# EAGLE design HLM1_Outsourced_V2 (EAGLE 9.0.0)
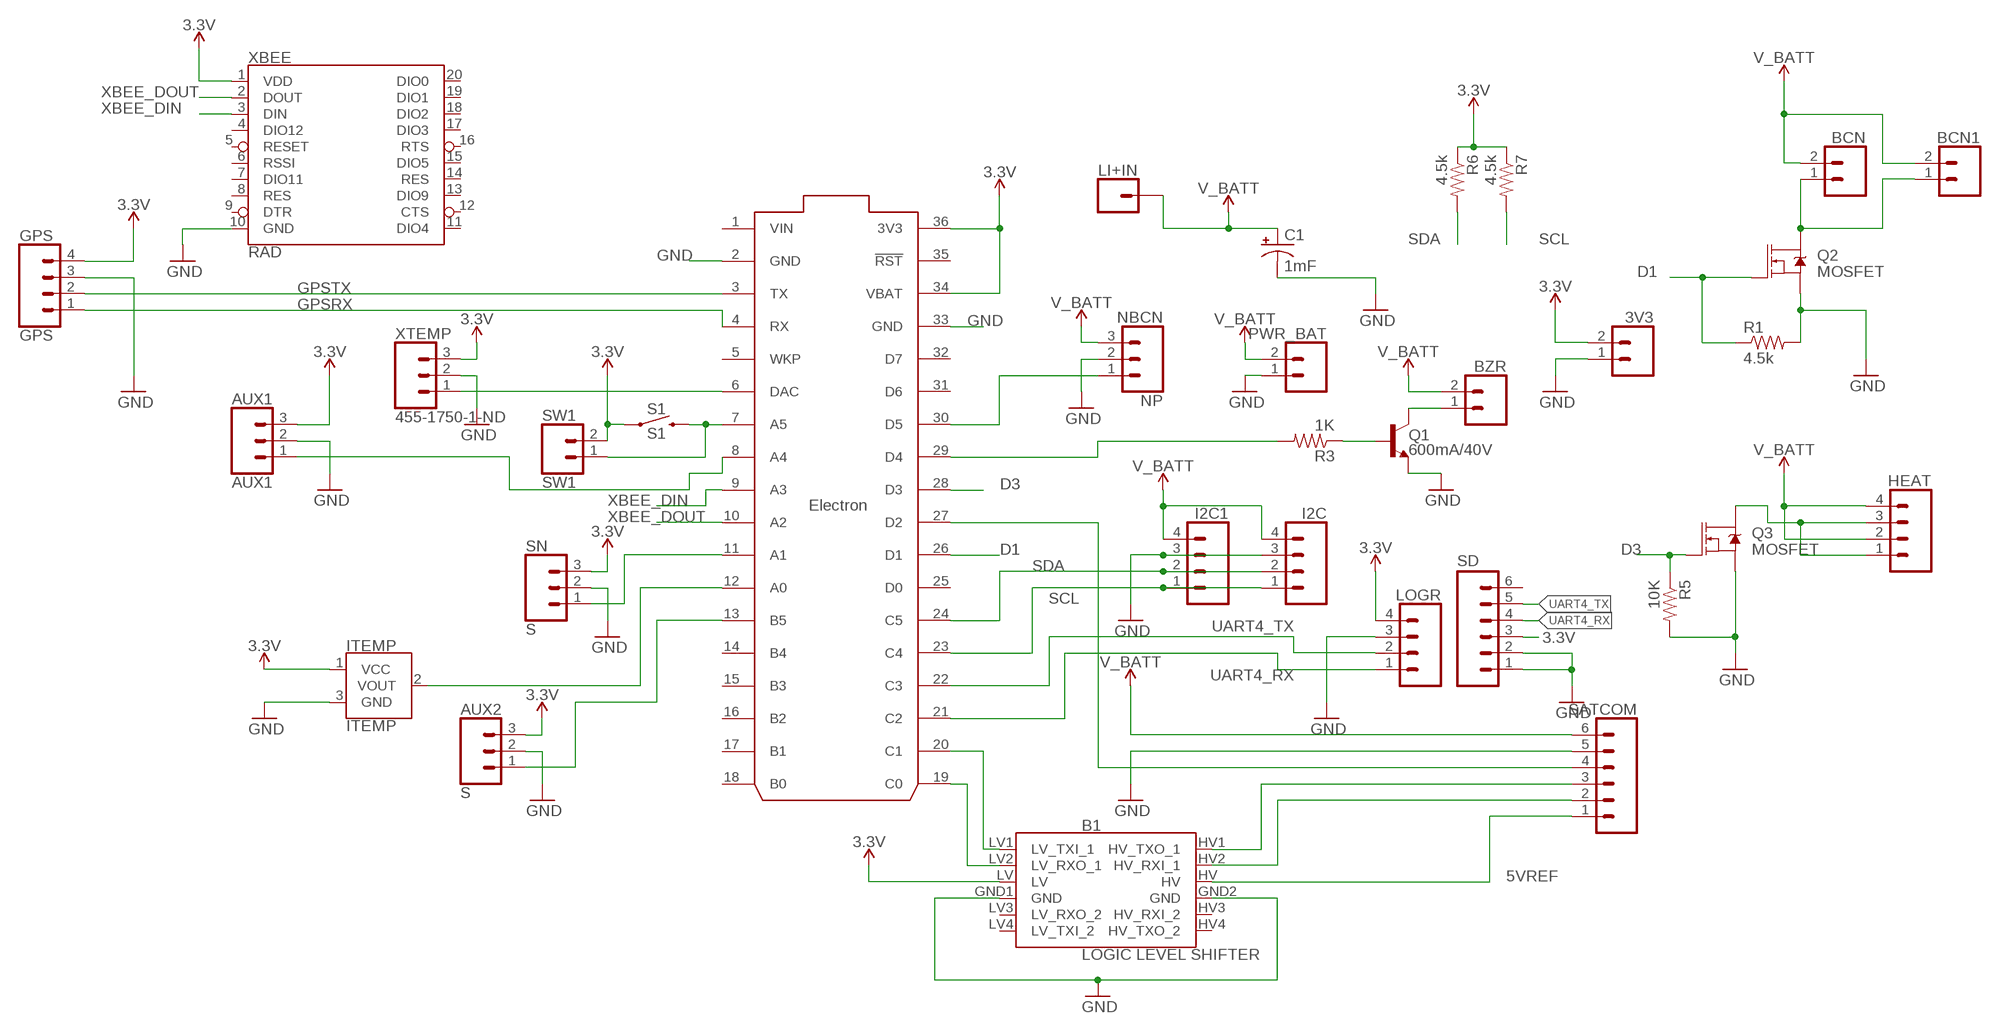
[diagram p0: schematic, sheet 1]

## Parts
3V3  CONN_02  [1X02]
AUX1  AUX1  CONN_03  [1X03]
AUX2  S  CONN_03  [1X03]
B1  LOGIC LEVEL SHIFTER  SPARKFUN_LOGIC_LEVEL_CONVERTER  [SPARKFUN_LOGIC_LEVEL_CONVERTER]
BCN  CONN_02  [1X02]
BCN1  CONN_02  [1X02]
BZR  CONN_02  [1X02]
C1  1mF  1000UF-RADIAL-5MM-25V-20%  [CPOL-RADIAL-5MM-10MM]
GPS  GPS  CONN_04  [1X04]
HEAT  CONN_04  [1X04]
I2C  CONN_04  [1X04]
I2C1  CONN_04  [1X04]
ITEMP  ITEMP  TMP36GT9  [TO-92]
LI+IN  CONN_01  [1X01]
LOGR  CONN_04  [1X04]
MCU  ELECTRON  ELECTRON_WITH_HEADERS  [ELECTRON]
NBCN  NP  CONN_03  [1X03]
PWR_BAT  CONN_02  [1X02]
Q1  600mA/40V  TRANS_NPN-P2N2222A  [TO-92]
Q2  MOSFET  MOSFET-NCH-FQP30N06L  [TO220V]
Q3  MOSFET  MOSFET-NCH-FQP30N06L  [TO220V]
R1  4.5k  RESISTORPTH-1/6W  [1/6W-RES]
R3  1K  RESISTORPTH-1/6W  [1/6W-RES]
R5  10K  RESISTORPTH-1/6W  [1/6W-RES]
R6  4.5k  RESISTORPTH-1/6W  [1/6W-RES]
R7  4.5k  RESISTORPTH-1/6W  [1/6W-RES]
S1  S1  MOMENTARY-SWITCH-SPST-PTH-6.0MM  [TACTILE_SWITCH_PTH_6.0MM]
SATCOM  CONN_06SILK_FEMALE_PTH  [1X06@1]
SD  M06NO_SILK_FEMALE_PTH  [1X06_NO_SILK]
SN  S  CONN_03  [1X03]
SW1  SW1  CONN_02  [1X02]
XBEE  RAD  XBEELONGPAD  [XBEE-LONGPAD]
XTEMP  455-1750-1-ND  CONN_03  [1X03]

## Nets
3.3V: 3V3.2 AUX1.3 AUX2.3 B1.LV GPS.4 ITEMP.1(VCC) LOGR.4 MCU.34(VBAT) MCU.36(3V3) R6.1 R7.1 S1.1 SD.3 SN.3 SW1.2 XBEE.1(VDD) XTEMP.3
5VREF: B1.HV SATCOM.1
D1: MCU.26(D1) Q2.1(G) R1.1
D3: MCU.28(D3) Q3.1(G) R5.1
GND: 3V3.1 AUX1.2 AUX2.2 B1.GND1(GND) B1.GND2(GND) C1.- GPS.3 I2C1.3 I2C.3 ITEMP.3(GND) LOGR.3 MCU.2(GND) MCU.33(GND) NBCN.2 PWR_BAT.1 Q1.3(E) Q2.3(S) Q3.3(S) R1.2 R5.2 SATCOM.5 SD.1 SD.2 SN.2 XBEE.10(GND) XTEMP.2
GPSRX: GPS.1 MCU.4(RX)
GPSTX: GPS.2 MCU.3(TX)
IRWKP: MCU.27(D2) SATCOM.4
N$1: MCU.6(DAC) XTEMP.1
N$3: MCU.29(D4) R3.2
N$4: Q1.2(B) R3.1
N$5: MCU.30(D5) NBCN.1
N$6: B1.LV1(LV_TXI_1) MCU.20(C1)
N$7: B1.LV2(LV_RXO_1) MCU.19(C0)
N$9: BZR.1 Q1.1(C)
N$10: B1.HV1(HV_TXO_1) SATCOM.3
N$11: HEAT.1 HEAT.3 Q3.2(D)
N$13: BCN1.1 BCN.1 Q2.2(D)
N$14: B1.HV2(HV_RXI_1) SATCOM.2
N$15: MCU.7(A5) S1.3 SW1.1
N$17: MCU.11(A1) SN.1
N$21: ITEMP.2(VOUT) MCU.12(A0)
N$23: AUX2.1 MCU.13(B5)
N$24: AUX1.1 MCU.8(A4)
SCL: I2C1.1 I2C.1 MCU.23(C4) R7.2
SDA: I2C1.2 I2C.2 MCU.24(C5) R6.2
UART4_RX: LOGR.1 MCU.21(C2) SD.4
UART4_TX: LOGR.2 MCU.22(C3) SD.5
V_BATT: BCN1.2 BCN.2 BZR.2 C1.+ HEAT.2 HEAT.4 I2C1.4 I2C.4 LI+IN.1 NBCN.3 PWR_BAT.2 SATCOM.6
XBEE_DIN: MCU.9(A3) XBEE.3(DIN)
XBEE_DOUT: MCU.10(A2) XBEE.2(DOUT)
Unconnected: B1.HV3(HV_RXI_2) B1.HV4(HV_TXO_2) B1.LV3(LV_RXO_2) B1.LV4(LV_TXI_2) MCU.5(WKP) MCU.14(B4) MCU.15(B3) MCU.16(B2) MCU.17(B1) MCU.18(B0) MCU.25(D0) MCU.31(D6) MCU.32(D7) MCU.35(!RST) SD.6 XBEE.4(DIO12) XBEE.5(RESET) XBEE.6(RSSI) XBEE.7(DIO11) XBEE.8(RES) XBEE.9(DTR) XBEE.11(DIO4) XBEE.12(CTS) XBEE.13(DIO9) XBEE.14(RES) XBEE.15(DIO5) XBEE.16(RTS) XBEE.17(DIO3) XBEE.18(DIO2) XBEE.19(DIO1) XBEE.20(DIO0)

## Power pins joined to a net without a drawn wire
VIN: MCU.1(VIN)

## Library data of the parts
3V3 BCN BCN1 BZR PWR_BAT SW1 = SparkFun-Connectors:CONN_02: Multi connection point. Often used as Generic Header-pin footprint for 0.1 inch spaced/style header connections On any of the 0.1 inch spaced packages, you can populate with these: Break Away Headers - Straight <https://www.sparkfun.com/products/116> (PRT-00116) Break Away Male Headers - Right Angle <https://www.sparkfun.com/products/553> (PRT-00553) Female Headers <https://www.sparkfun.com/products/115> (PRT-00115) Break Away Headers - Machine Pin <https://www.sparkfun.com/products/117> (PRT-00117) Break Away Female Headers - Swiss Machine Pin <https://www.sparkfun.com/products/743> (PRT-00743) For SCREWTERMINALS and SPRING TERMINALS visit here: Screw Terimnals on SparkFun.com <https://www.sparkfun.com/search/results?term=Screw+Terminals> (5mm/3.5mm/2.54mm spacing) This device is also useful as a general connection point to wire up your design to another part of your project. Our various solder wires solder well into these plated through hole pads. Hook-Up Wire - Assortment (Stranded, 22 AWG) <https://www.sparkfun.com/products/11375> (PRT-11375) Hook-Up Wire - Assortment (Solid Core, 22 AWG) <https://www.sparkfun.com/products/11367> (PRT-11367) View the entire wire category on our website here <https://www.sparkfun.com/categories/141> Special notes: Molex polarized connector foot print use with: PRT-08233 with associated crimp pins and housings. 2.54_SCREWTERM for use with PRT-10571. 3.5mm Screw Terminal footprints for PRT-08084 5mm Screw Terminal footprints for use with PRT-08432
AUX1 AUX2 NBCN SN = SparkFun-Connectors:CONN_03: Multi connection point. Often used as Generic Header-pin footprint for 0.1 inch spaced/style header connections On any of the 0.1 inch spaced packages, you can populate with these: Break Away Headers - Straight <https://www.sparkfun.com/products/116> (PRT-00116) Break Away Male Headers - Right Angle <https://www.sparkfun.com/products/553> (PRT-00553) Female Headers <https://www.sparkfun.com/products/115> (PRT-00115) Break Away Headers - Machine Pin <https://www.sparkfun.com/products/117> (PRT-00117) Break Away Female Headers - Swiss Machine Pin <https://www.sparkfun.com/products/743> (PRT-00743) Stackable Header - 3 Pin (Female, 0.1") <https://www.sparkfun.com/products/13875> (PRT-13875) For SCREWTERMINALS and SPRING TERMINALS visit here: Screw Terimnals on SparkFun.com <https://www.sparkfun.com/search/results?term=Screw+Terminals> (5mm/3.5mm/2.54mm spacing) This device is also useful as a general connection point to wire up your design to another part of your project. Our various solder wires solder well into these plated through hole pads. Hook-Up Wire - Assortment (Stranded, 22 AWG) <https://www.sparkfun.com/products/11375> (PRT-11375) Hook-Up Wire - Assortment (Solid Core, 22 AWG) <https://www.sparkfun.com/products/11367> (PRT-11367) View the entire wire category on our website here <https://www.sparkfun.com/categories/141> Special notes: Molex polarized connector foot print use with SKU : PRT-08232 with associated crimp pins and housings.; PROD_ID: XXX-00000; VALUE: 455-1750-1-ND
B1 = SparkFun-Boards:SPARKFUN_LOGIC_LEVEL_CONVERTER: SparkFun Logic Level Converter -Bi-Directional This is the mechnical outline for the 3.3V - 5V bi directional logic level converter. *Note, the "LOCK" Package has the header pins staggered by an offset of 5 mils (off center line), so that when you slide a row of standard 0.1" headers into the PTH pads, it will hold position vertically. See the follwing turorial for more information on this type of special footprints: Sneaky Footprints <https://www.sparkfun.com/tutorials/114> SparkFun Products: SparkFun Logic Level Converter - Bi-Directional <https://www.sparkfun.com/products/12009>
C1 = SparkFun-Capacitors:1000UF: 1,000µF/1mF ceramic capacitors A capacitor is a passive two-terminal electrical component used to store electrical energy temporarily in an electric field. CAP-08070; PROD_ID: CAP-09538
GPS HEAT I2C I2C1 LOGR = SparkFun-Connectors:CONN_04: Multi connection point. Often used as Generic Header-pin footprint for 0.1 inch spaced/style header connections On any of the 0.1 inch spaced packages, you can populate with these: Break Away Headers - Straight <https://www.sparkfun.com/products/116> (PRT-00116) Break Away Male Headers - Right Angle <https://www.sparkfun.com/products/553> (PRT-00553) Female Headers <https://www.sparkfun.com/products/115> (PRT-00115) Break Away Headers - Machine Pin <https://www.sparkfun.com/products/117> (PRT-00117) Break Away Female Headers - Swiss Machine Pin <https://www.sparkfun.com/products/743> (PRT-00743) For SCREWTERMINALS and SPRING TERMINALS visit here: Screw Terimnals on SparkFun.com <https://www.sparkfun.com/search/results?term=Screw+Terminals> (5mm/3.5mm/2.54mm spacing) This device is also useful as a general connection point to wire up your design to another part of your project. Our various solder wires solder well into these plated through hole pads. Hook-Up Wire - Assortment (Stranded, 22 AWG) <https://www.sparkfun.com/products/11375> (PRT-11375) Hook-Up Wire - Assortment (Solid Core, 22 AWG) <https://www.sparkfun.com/products/11367> (PRT-11367) View the entire wire category on our website here <https://www.sparkfun.com/categories/141> Special notes: Molex polarized connector foot print use with SKU : PRT-08231 with associated crimp pins and housings. 1MM SMD Version SKU: PRT-10208; PROD_ID: CONN-09696
ITEMP = SparkFun-Sensors:TMP36: TMP36 Precision Analog °C Temperature Sensor The TMP36 is a low voltage, precision centigrade temperature sensor. It provides a voltage output that is linearly proportional to the Celsius temperature. It also doesn’t require any external calibration to provide typical accuracies of ±1°C at +25°C and ±2°C over the −40°C to +125°C temperature range. We like it because it’s so easy to use: Just give the device a ground and 2.7 to 5.5 VDC and read the voltage on the Vout pin. The output voltage can be converted to temperature easily using the scale factor of 10 mV/°C. Datasheet <http://cdn.sparkfun.com/datasheets/Sensors/Temp/TMP35_36_37.pdf> SparkFun Products Temperature Sensor - TMP36 <https://www.sparkfun.com/products/10988> (SEN-10988) SparkFun Danger Shield <https://www.sparkfun.com/products/11649> (DEV-11649); PROD_ID: IC-09880; SF_ID: SEN-10988
LI+IN = SparkFun-Connectors:CONN_01: Single connection point. Often used as Generic Header-pin footprint for 0.1 inch spaced/style header connections On any of the 0.1 inch spaced packages, you can populate with these: Break Away Headers - Straight <https://www.sparkfun.com/products/116> (PRT-00116) Break Away Male Headers - Right Angle <https://www.sparkfun.com/products/553> (PRT-00553) Female Headers <https://www.sparkfun.com/products/115> (PRT-00115) Break Away Headers - Machine Pin <https://www.sparkfun.com/products/117> (PRT-00117) Break Away Female Headers - Swiss Machine Pin <https://www.sparkfun.com/products/743> (PRT-00743) This device is also useful as a general connection point to wire up your design to another part of your project. Our various solder wires solder well into these plated through hole pads. Hook-Up Wire - Assortment (Stranded, 22 AWG) <https://www.sparkfun.com/products/11375> (PRT-11375) Hook-Up Wire - Assortment (Solid Core, 22 AWG) <https://www.sparkfun.com/products/11367> (PRT-11367) View the entire wire category on our website here <https://www.sparkfun.com/categories/141> Special notes: SMTSO-256-ET is a "flush mount" nut for a 4-40 screw. We mostly use this on specialty testbeds; it is a nice way to connect hardware to your PCB at an adjustable hieght. Also note, the SNAP packages are for using a snappable style connector. We sell a baggie of snaps and they are also used on two LilyPad designs: Snap Assortment - 30 pack (male and female) <https://www.sparkfun.com/products/11347> (DEV-11347) LilyPad Arduino SimpleSnap <https://www.sparkfun.com/products/10941> (DEV-10941) LilyPad SimpleSnap Protoboard <https://www.sparkfun.com/products/10940> (DEV-10940)
MCU = Particle-Devices:ELECTRON: Particle Electron footprint
Q1 = SparkFun-DiscreteSemi:TRANS_NPN: NPN transistor Current controlled devices typically used to amplify current or used as a switch. BC547 - COM-08928 <http://www.sparkfun.com/products/8928> (TO-92 45V 100mA) (1.Collector 2.Base 3.Emitter) 2N3904 - COM-00521 <http://www.sparkfun.com/products/521> (TO-92 40V 200mA) (1.Emitter 2.Base 3.Collector) P2N2222A - COM-12852 <http://www.sparkfun.com/products/12852> (TO-92 40V 600mA) (1.Collector 2.Base 3.Emitter); PROD_ID: TRANS-09536
Q2 Q3 = SparkFun-DiscreteSemi:MOSFET-NCH: N-channel MOSFETs Voltage controlled devices that allow control of high current outputs. SparkFun Products: SparkFun OpenScale <https://www.sparkfun.com/products/13261> SparkFun Digital Sandbox <https://www.sparkfun.com/products/12651> SparkFun Monster Moto Shield <https://www.sparkfun.com/products/10182> SparkFun MOSFET Power Controller <https://www.sparkfun.com/products/11214>; PROD_ID: TRANS-10060; VALUE: 60V/32A/35mΩ
R1 R3 R5-R7 = SparkFun-Passives:RESISTOR: Resistor Basic schematic elements and footprints for 0603, 1206, and PTH resistors.
S1 = SparkFun-Switches:MOMENTARY-SWITCH-SPST: Momentary Switch (Pushbutton) - SPST Normally-open (NO) SPST momentary switches (buttons, pushbuttons). Variants PTH-12MM - 12mm square, through-hole Momentary Pushbutton Switch - 12mm Square <https://www.sparkfun.com/products/9190> (COM-09190) PTH-6.0MM, PTH-6.0MM-KIT - 6.0mm square, through-hole Mini Pushbutton Switch <https://www.sparkfun.com/products/97> (COM-00097) KIT package intended for soldering kit's - only one side of pads' copper is exposed. PTH-RIGHT-ANGLE-KIT - Right-angle, through-hole Right Angle Tactile Button <https://www.sparkfun.com/products/10791> - Used on SparkFun BigTime Watch Kit <https://www.sparkfun.com/products/11734> SMD-12MM - 12mm square, surface-mount Tactile Button - SMD (12mm) <https://www.sparkfun.com/products/12993> (COM-12993) Used on SparkFun PicoBoard <https://www.sparkfun.com/products/11888> SMD-4.5MM - 4.5mm Square Trackball Switch Used on SparkFun Blackberry Trackballer Breakout <https://www.sparkfun.com/products/13169> SMD-4.6MMX2.8MM - 4.60mm x 2.80mm, surface mount Used on SparkFun SAMD21 Mini Breakout <https://www.sparkfun.com/products/13664> SMD-5.2MM, SMD-5.2-REDUNDANT - 5.2mm square, surface-mount Mini Pushbutton Switch - SMD <https://www.sparkfun.com/products/8720> (COM-08720) Used on Arduino Pro Mini <https://www.sparkfun.com/products/11114> REDUNDANT package connects both switch circuits together SMD-6.0X3.5MM - 6.0 x 3.5mm, surface mount Momentary Reset Switch SMD <https://www.sparkfun.com/products/8229> (COM-08229) SMD-6.2MM-TALL - 6.2mm square, surface mount Tactile Button - SMD (6mm) <https://www.sparkfun.com/products/12992> Used on SparkFun Digital Sandbox <https://www.sparkfun.com/products/12651> SMD-RIGHT-ANGLE - Right-angle, surface mount Used on SparkFun Block for Intel® Edison - Arduino <https://www.sparkfun.com/products/13036>; PROD_ID: SWCH-08441; SF_SKU: COM-00097
SATCOM = SparkFun-Connectors:CONN_06: Multi connection point. Often used as Generic Header-pin footprint for 0.1 inch spaced/style header connections On any of the 0.1 inch spaced packages, you can populate with these: Break Away Headers - Straight <https://www.sparkfun.com/products/116> (PRT-00116) Break Away Male Headers - Right Angle <https://www.sparkfun.com/products/553> (PRT-00553) Female Headers <https://www.sparkfun.com/products/115> (PRT-00115) Break Away Headers - Machine Pin <https://www.sparkfun.com/products/117> (PRT-00117) Break Away Female Headers - Swiss Machine Pin <https://www.sparkfun.com/products/743> (PRT-00743) Arduino Stackable Header - 6 Pin <https://www.sparkfun.com/products/9280> (PRT-09280) For SCREWTERMINALS and SPRING TERMINALS visit here: Screw Terimnals on SparkFun.com <https://www.sparkfun.com/search/results?term=Screw+Terminals> (5mm/3.5mm/2.54mm spacing) This device is also useful as a general connection point to wire up your design to another part of your project. Our various solder wires solder well into these plated through hole pads. Hook-Up Wire - Assortment (Stranded, 22 AWG) <https://www.sparkfun.com/products/11375> (PRT-11375) Hook-Up Wire - Assortment (Solid Core, 22 AWG) <https://www.sparkfun.com/products/11367> (PRT-11367) View the entire wire category on our website here <https://www.sparkfun.com/categories/141>; PROD_ID: CONN-08437
SD = SparkFun-Connectors:M06: Header 6 Standard 6-pin 0.1" header. Use with straight break away headers (SKU : PRT-00116), right angle break away headers (PRT-00553), swiss pins (PRT-00743), machine pins (PRT-00117), and female headers (PRT-00115). Molex polarized connector foot print use with SKU : PRT-08094 with associated crimp pins and housings. NOTES ON THE VARIANTS LOCK and LOCK_LONGPADS... This footprint was designed to help hold the alignment of a through-hole component (i.e. 6-pin header) while soldering it into place. You may notice that each hole has been shifted either up or down by 0.005 of an inch from it's more standard position (which is a perfectly straight line). This slight alteration caused the pins (the squares in the middle) to touch the edges of the holes. Because they are alternating, it causes a "brace" to hold the component in place. 0.005 has proven to be the perfect amount of "off-center" position when using our standard breakaway headers. Although looks a little odd when you look at the bare footprint, once you have a header in there, the alteration is very hard to notice. Also,if you push a header all the way into place, it is covered up entirely on the bottom side. This idea of altering the position of holes to aid alignment will be further integrated into the Sparkfun Library for other footprints. It can help hold any component with 3 or more connection pins.; PROD_ID: CONN-08437
XBEE = SparkFun-RF:XBEE: Digi XBee and XBee Pro XBees are tiny blue chips that can communicate wirelessly with each other. They can do simple things, like replacing a couple of wires in serial communication, which is nice when you want to make a remote for your paintball vehicle. SparkFun Products SparkFun XBee Buying Guide <https://www.sparkfun.com/pages/xbee_guide> SparkFun XBee Explorer USB <https://www.sparkfun.com/products/11812> (WRL-11812) Breakout Board for XBee Module <https://www.sparkfun.com/products/8276> (WRL-8276) SparkFun XBee Explorer Regulated <https://www.sparkfun.com/products/11373> (WRL-11373) SparkFun XBee Explorer Dongle <https://www.sparkfun.com/products/11697> (WRL-11697) SparkFun XBee Shield <https://www.sparkfun.com/products/12847> (WRL-12847) SparkFun XBee Explorer Serial <https://www.sparkfun.com/products/13225> (WRL-13225)
XTEMP = SparkFun-Connectors:CONN_03: Multi connection point. Often used as Generic Header-pin footprint for 0.1 inch spaced/style header connections On any of the 0.1 inch spaced packages, you can populate with these: Break Away Headers - Straight <https://www.sparkfun.com/products/116> (PRT-00116) Break Away Male Headers - Right Angle <https://www.sparkfun.com/products/553> (PRT-00553) Female Headers <https://www.sparkfun.com/products/115> (PRT-00115) Break Away Headers - Machine Pin <https://www.sparkfun.com/products/117> (PRT-00117) Break Away Female Headers - Swiss Machine Pin <https://www.sparkfun.com/products/743> (PRT-00743) Stackable Header - 3 Pin (Female, 0.1") <https://www.sparkfun.com/products/13875> (PRT-13875) For SCREWTERMINALS and SPRING TERMINALS visit here: Screw Terimnals on SparkFun.com <https://www.sparkfun.com/search/results?term=Screw+Terminals> (5mm/3.5mm/2.54mm spacing) This device is also useful as a general connection point to wire up your design to another part of your project. Our various solder wires solder well into these plated through hole pads. Hook-Up Wire - Assortment (Stranded, 22 AWG) <https://www.sparkfun.com/products/11375> (PRT-11375) Hook-Up Wire - Assortment (Solid Core, 22 AWG) <https://www.sparkfun.com/products/11367> (PRT-11367) View the entire wire category on our website here <https://www.sparkfun.com/categories/141> Special notes: Molex polarized connector foot print use with SKU : PRT-08232 with associated crimp pins and housings.; PROD_ID: XXX-00000

## Net classes
0 default: width 0.178 mm
1 vcc: width 0.203 mm

## Board
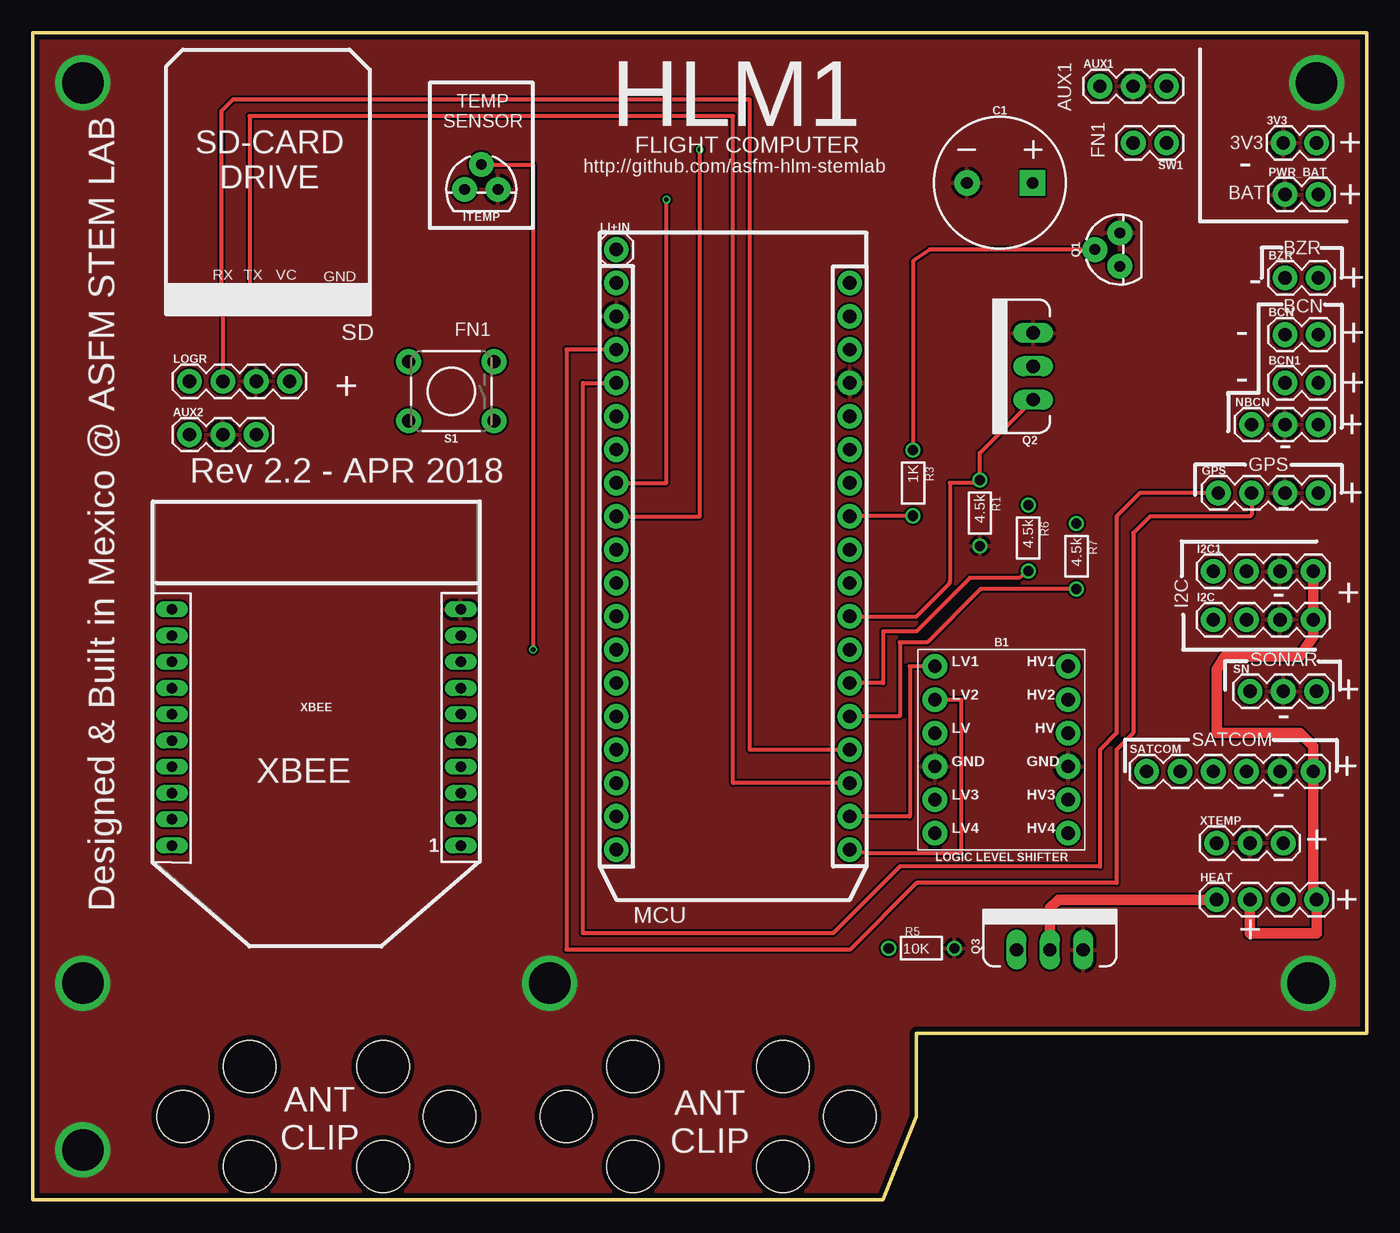
[diagram p1: board, top side]
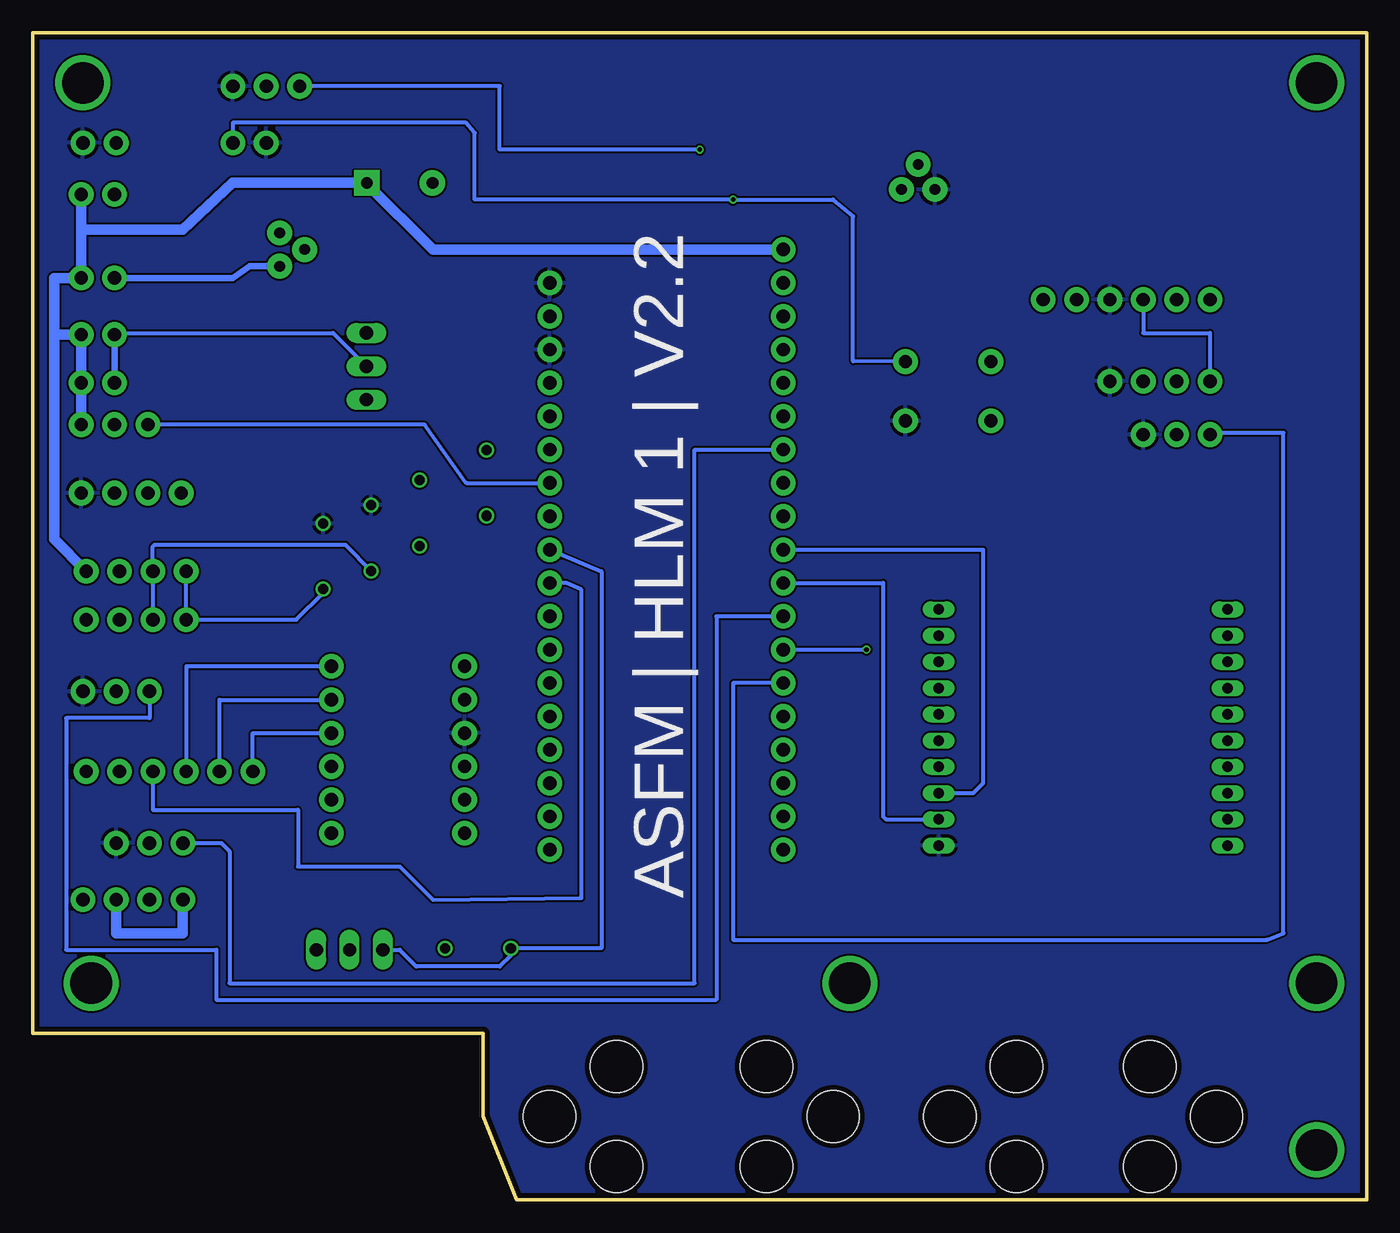
[diagram p2: board, bottom side, seen from below]

Size 101.6 x 88.9 mm. Coordinates in mm from the lower left corner, seen from the top.
Outline: 101.6,12.7 67.31,12.7 67.31,6.35 64.77,0 0,0 0,88.9 101.6,88.9 101.6,12.7
Copper layers (1*16): Top 0.035559375mm / dielectric 1.6mm / Bottom 0.035559375mm
Design rules "oshpark-2layer": minimum track width 6mil, minimum drill 10mil, track to track 6mil, track to pad 6mil, pad to pad 6mil, via to via 6mil, smd to smd 6mil, copper to edge 15mil, drill to drill 6mil, minimum pad ring 5mil, minimum via ring 5mil, stop-mask expansion 2.5mil, vias tented up to drill 0mil, thermal gap 10mil
Holes 4 mm at 57.15,10.16 57.15,2.54 45.72,10.16 45.72,2.54 26.67,10.16 16.51,10.16 26.67,2.54 16.51,2.54 11.43,6.35 40.64,6.35 62.23,6.35 31.75,6.35

### Footprints (pad centres in the part's own frame; a part is rotated, then mirrored left to right if it is on the bottom)
1X02 = drill 1.016 pad 1.88: 1 0,0; 2 2.54,0
1X03 = drill 1.016 pad 1.88: 1 0,0; 2 2.54,0; 3 5.08,0
SPARKFUN_LOGIC_LEVEL_CONVERTER = drill 1.016 pad 1.88: GND1 -5.08,-1.27; GND2 5.08,-1.27; HV 5.08,1.27; HV1 5.08,6.35; HV2 5.08,3.81; HV3 5.08,-3.81; HV4 5.08,-6.35; LV -5.08,1.27; LV1 -5.08,6.35; LV2 -5.08,3.81; LV3 -5.08,-3.81; LV4 -5.08,-6.35
CPOL-RADIAL-5MM-10MM = drill 0.9 pad 1.93 square: + 2.5,0 | drill 0.9 pad 1.93: - -2.5,0
1X04 = drill 1.016 pad 1.88: 1 0,0; 2 2.54,0; 3 5.08,0; 4 7.62,0
TO-92 = drill 0.813 pad 1.88: 1 -1.27,0; 2 0,1.905; 3 1.27,0
1X01 = drill 1.016 pad 1.88: 1 0,0
ELECTRON = drill 1.016 pad 1.88: 1 1.27,46.99; 2 1.27,44.45; 3 1.27,41.91; 4 1.27,39.37; 5 1.27,36.83; 6 1.27,34.29; 7 1.27,31.75; 8 1.27,29.21; 9 1.27,26.67; 10 1.27,24.13; 11 1.27,21.59; 12 1.27,19.05; 13 1.27,16.51; 14 1.27,13.97; 15 1.27,11.43; 16 1.27,8.89; 17 1.27,6.35; 18 1.27,3.81; 19 19.05,3.81; 20 19.05,6.35; 21 19.05,8.89; 22 19.05,11.43; 23 19.05,13.97; 24 19.05,16.51; 25 19.05,19.05; 26 19.05,21.59; 27 19.05,24.13; 28 19.05,26.67; 29 19.05,29.21; 30 19.05,31.75; 31 19.05,34.29; 32 19.05,36.83; 33 19.05,39.37; 34 19.05,41.91; 35 19.05,44.45; 36 19.05,46.99
TO220V = drill 1.016 long: 1 -2.54,0; 2 0,0; 3 2.54,0
1/6W-RES = drill 0.762: 1 -2.5,0; 2 2.5,0
TACTILE_SWITCH_PTH_6.0MM = drill 1.016 pad 1.88: 1 -3.251,2.261; 2 3.251,2.261; 3 -3.251,-2.261; 4 3.251,-2.261
1X06@1 = drill 1.016 pad 1.88: 1 0,0; 2 2.54,0; 3 5.08,0; 4 7.62,0; 5 10.16,0; 6 12.7,0
1X06_NO_SILK = drill 1.016 pad 1.88: 1 0,0; 2 2.54,0; 3 5.08,0; 4 7.62,0; 5 10.16,0; 6 12.7,0
XBEE-LONGPAD = drill 0.8 pad 1.206 long: 1 -11,20; 2 -11,18; 3 -11,16; 4 -11,14; 5 -11,12; 6 -11,10; 7 -11,8; 8 -11,6; 9 -11,4; 10 -11,2; 11 11,2; 12 11,4; 13 11,6; 14 11,8; 15 11,10; 16 11,12; 17 11,14; 18 11,16; 19 11,18; 20 11,20

### Placement (x,y rotation side)
3V3  95.25,80.52 0 top
AUX1  81.28,84.84 0 top
AUX2  11.94,58.29 0 top
B1  73.79,34.29 0 top
BCN  95.38,65.91 0 top
BCN1  95.38,62.23 0 top
BZR  95.38,70.23 0 top
C1  73.66,77.47 0 top
GPS  90.3,53.85 0 top
HEAT  90.17,22.86 0 top
I2C  89.92,44.2 0 top
I2C1  89.92,47.88 0 top
ITEMP  34.16,76.96 0 top
LI+IN  44.45,72.39 0 top
LOGR  11.94,62.36 0 top
MCU  43.18,22.86 0 top
NBCN  92.84,59.05 0 top
PWR_BAT  95.38,76.58 0 top
Q1  82.8,72.39 90 top
Q2  76.2,63.5 90 top
Q3  77.47,19.05 0 top
R1  72.14,52.32 270 top
R3  67.06,54.61 270 top
R5  67.69,19.18 0 top
R6  75.82,50.42 270 top
R7  79.5,49.02 270 top
S1  31.88,61.59 180 top
SATCOM  84.84,32.64 0 top
SD  24.64,68.58 180 top
SN  92.71,38.73 0 top
SW1  86.36,80.52 180 top
XBEE  21.59,46.99 180 top
XTEMP  90.17,27.18 0 top

### Tracks (layer width: path | path; a pad name or v marks a point on that pad's centre or on a via)
3.3V
  pour Bottom: 0,91.44 104.14,91.44 104.14,0 -1.27,-1.27
5VREF
  Bottom 0.305: SATCOM.1 84.84,35.56 B1.HV
D1
  Top 0.305: Q2.1 72.14,56.9 R1.1 71.92,54.61 69.85,54.61 69.85,47.12 69.85,46.99 67.31,44.45 MCU.26
D3
  Bottom 0.305: Q3.1 73.66,19.05 72.39,17.78 66.04,17.78 65.19,18.63 R5.1 58.29,19.18 58.29,47.88 MCU.28
GND  (via drill 3.17)
  other vias: 3.81,85.09 97.79,85.09 97.16,16.51 3.81,16.51 3.81,3.81 39.37,16.51
  pour Top: 0,90.17 -1.27,-1.27 104.14,0 104.14,90.17
GPSRX
  Top 0.305: GPS.1 84.33,53.85 82.55,52.07 82.55,35.56 81.28,34.29 81.28,25.4 66.04,25.4 60.96,20.32 41.91,20.32 41.91,62.23 MCU.4
GPSTX
  Top 0.305: GPS.2 92.84,52.2 92.71,52.07 85.09,52.07 83.82,50.8 83.82,35.56 82.55,34.29 82.55,24.13 67.31,24.13 62.23,19.05 40.64,19.05 40.64,64.77 MCU.3
IRWKP
  Bottom 0.305: SATCOM.4 92.46,29.72 81.41,29.72 81.41,25.4 73.66,25.4 71.12,22.86 59.82,22.99 59.82,46.48 60.96,46.99 MCU.27
N$1
  Bottom 0.305: MCU.6 51.18,57.15 51.18,16.51 86.61,16.51 86.61,26.54 87.25,27.18 XTEMP.1
N$3
  Top 0.305: R3.2 62.27,52.11 MCU.29
N$4
  Top 0.305: Q1.2 68.33,72.39 67.06,71.5 R3.1
N$5
  Bottom 0.305: MCU.30 68.58,54.61 71.75,59.05 NBCN.1
N$6
  Top 0.305: B1.LV1 66.8,40.64 66.8,29.21 MCU.20
N$7
  Top 0.305: B1.LV2 70.74,38.1 70.74,26.42 63.5,26.42 MCU.19
N$9
  Bottom 0.508: BZR.1 86.36,70.23 85.09,71.12 Q1.1 82.55,71.12
N$10
  Bottom 0.305: B1.HV1 89.92,40.64 SATCOM.3
N$11
  Top 0.813: HEAT.1 78.11,22.86 77.47,22.23 Q3.2
  Bottom 0.813: HEAT.3 95.25,20.32 90.17,20.32 HEAT.1
N$13
  Bottom 0.305: BCN.1 95.12,66.04 78.74,66.04 Q2.2
  Bottom 0.508: BCN.1 BCN1.1
N$14
  Bottom 0.305: SATCOM.2 87.38,38.1 B1.HV2
N$15  (via drill 0.35)
  Top 0.305: MCU.7 48.26,54.61 v48.26,76.2
  Bottom 0.305: SW1.1 86.36,82.04 68.58,82.04 67.95,81.28 67.95,76.2 v48.26,76.2 40.64,76.2 39.12,74.93 39.12,63.88 S1.3
N$17
  Bottom 0.305: MCU.11 49.53,44.45 49.53,15.24 87.63,15.24 87.63,19.05 99.06,19.05 99.06,36.7 92.71,36.7 SN.1
N$21  (via drill 0.35)
  Top 0.305: v38.1,41.91 38.1,78.87 ITEMP.2
  Bottom 0.305: MCU.12 v38.1,41.91
N$23
  Bottom 0.305: MCU.13 48.26,39.37 48.26,19.81 7.62,19.81 6.35,20.32 6.35,58.42 11.81,58.42 AUX2.1
N$24  (via drill 0.35)
  Top 0.305: MCU.8 50.8,52.07 v50.8,80.01
  Bottom 0.305: v50.8,80.01 66.04,80.01 66.04,84.84 AUX1.1
SCL
  Top 0.305: R7.2 72.19,46.52 68.13,42.47 66.04,42.47 66.04,36.83 MCU.23
  Bottom 0.305: R7.2 79.5,46.23 81.53,44.2 I2C.1 I2C1.1
SDA
  Top 0.305: R6.2 75.14,47.37 71.37,47.37 67.31,43.31 64.77,43.31 64.77,39.37 MCU.24
  Bottom 0.305: R6.2 77.81,49.91 92.33,49.91 92.46,49.78 I2C1.2 I2C.2
UART4_RX
  Top 0.305: SD.4 16.51,69.09 16.51,82.55 53.34,82.55 53.34,31.75 MCU.21
  Bottom 0.305: SD.4 17.02,66.04 11.94,66.04 LOGR.1
UART4_TX
  Top 0.305: LOGR.2 SD.5 14.35,68.71 14.35,82.93 15.24,83.82 54.61,83.82 54.61,34.29 MCU.22
V_BATT
  Top 0.813: I2C1.4 I2C.4 97.54,42.93 96.52,41.4 90.8,41.4 90.17,40.39 90.17,35.56 96.52,35.56 97.54,34.54 SATCOM.6 97.54,23.11 HEAT.4 97.79,20.32 92.71,20.32 HEAT.2
  Bottom 0.813: 99.98,66.04 99.98,70.23 BZR.2 97.92,73.91 | 99.98,66.04 99.98,50.33 I2C1.4 | 97.92,73.91 PWR_BAT.2 | 97.92,73.91 90.17,73.91 86.36,77.47 C1.+ 76.2,77.43 71.12,72.39 LI+IN.1 | 99.98,66.04 99.86,65.91 BCN.2 BCN1.2 NBCN.3
XBEE_DIN
  Bottom 0.305: MCU.9 29.21,49.53 29.21,31.75 29.97,30.99 XBEE.3
XBEE_DOUT
  Bottom 0.305: MCU.10 36.83,46.99 36.83,29.21 36.61,28.99 XBEE.2

### Text on the board
tPlace: TEMP / SENSOR | AUX1 | HLM1 | SD-CARD / DRIVE | FLIGHT COMPUTER | FN1 | 3V3 | + | http://github.com/asfm-hlm-stemlab | - | BAT | + | BZR | RX | TX | VC | GND | - | + | BCN | FN1 | - | + | - | + | + | + | - | GPS | Rev 2.2 - APR 2018 | + | - | I2C | - | + | SONAR | + | - | SATCOM | XBEE | + | - | + | Designed & Built in Mexico @ ASFM STEM LAB | + | + | ANT / CLIP | ANT / CLIP
bPlace: ASFM | HLM 1 | V2.2